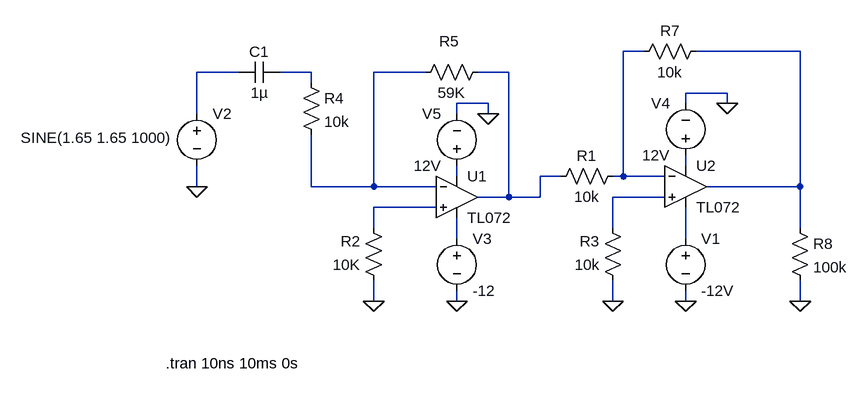
[diagram p0: schematic phr-eurpi-ext-03.asc]
phr-eurpi-ext-03.asc, the LTspice schematic file:
Version 4
SHEET 1 1072 680
WIRE 752 16 720 16
WIRE 992 16 832 16
WIRE 128 48 64 48
WIRE 240 48 192 48
WIRE 416 48 336 48
WIRE 544 48 496 48
WIRE 240 64 240 48
WIRE 880 80 816 80
WIRE 512 96 464 96
WIRE 816 96 816 80
WIRE 880 96 880 80
WIRE 64 112 64 48
WIRE 464 112 464 96
WIRE 512 112 512 96
WIRE 816 192 816 176
WIRE 464 208 464 192
WIRE 624 208 592 208
WIRE 720 208 720 16
WIRE 720 208 704 208
WIRE 784 208 720 208
WIRE 64 224 64 192
WIRE 240 224 240 144
WIRE 336 224 336 48
WIRE 336 224 240 224
WIRE 432 224 336 224
WIRE 992 224 992 16
WIRE 992 224 848 224
WIRE 544 240 544 48
WIRE 544 240 496 240
WIRE 592 240 592 208
WIRE 592 240 544 240
WIRE 784 240 704 240
WIRE 432 256 336 256
WIRE 336 288 336 256
WIRE 704 288 704 240
WIRE 992 288 992 224
WIRE 464 304 464 272
WIRE 816 304 816 256
WIRE 336 400 336 368
WIRE 464 400 464 384
WIRE 704 400 704 368
WIRE 816 400 816 384
WIRE 992 400 992 368
FLAG 64 224 0
FLAG 336 400 0
FLAG 464 400 0
FLAG 512 112 0
FLAG 816 400 0
FLAG 880 96 0
FLAG 704 400 0
FLAG 992 400 0
SYMBOL OpAmps/TL072 464 176 R0
SYMATTR InstName U1
SYMBOL Voltage 64 96 R0
WINDOW 3 -271 53 Left 2
SYMATTR InstName V2
SYMATTR Value SINE(1.65 1.65 1000)
SYMBOL Res 352 384 R180
WINDOW 0 36 76 Left 2
WINDOW 3 36 40 Left 2
SYMATTR InstName R2
SYMATTR Value 10K
SYMBOL Res 224 48 R0
SYMATTR InstName R4
SYMATTR Value 10k
SYMBOL Res 512 32 R90
WINDOW 0 -16 60 VBottom 2
WINDOW 3 32 56 VTop 2
SYMATTR InstName R5
SYMATTR Value 59K
SYMBOL Voltage 464 288 R0
SYMATTR InstName V3
SYMATTR Value -12
SYMBOL Voltage 464 208 R180
WINDOW 0 24 96 Left 2
WINDOW 3 24 16 Left 2
SYMATTR InstName V5
SYMATTR Value 12V
SYMBOL Cap 192 32 R90
WINDOW 0 0 32 VBottom 2
WINDOW 3 32 32 VTop 2
SYMATTR InstName C1
SYMATTR Value 1µ
SYMBOL OpAmps/TL072 816 160 R0
SYMATTR InstName U2
SYMBOL Voltage 816 288 R0
SYMATTR InstName V1
SYMATTR Value -12V
SYMBOL Voltage 816 192 R180
WINDOW 0 24 96 Left 2
WINDOW 3 24 16 Left 2
SYMATTR InstName V4
SYMATTR Value 12V
SYMBOL Res 720 192 R90
WINDOW 0 0 56 VBottom 2
WINDOW 3 32 56 VTop 2
SYMATTR InstName R1
SYMATTR Value 10k
SYMBOL Res 720 384 R180
WINDOW 0 36 76 Left 2
WINDOW 3 36 40 Left 2
SYMATTR InstName R3
SYMATTR Value 10k
SYMBOL Res 848 0 R90
WINDOW 0 0 56 VBottom 2
WINDOW 3 32 56 VTop 2
SYMATTR InstName R7
SYMATTR Value 10k
SYMBOL Res 976 272 R0
SYMATTR InstName R8
SYMATTR Value 100k
TEXT 16 496 Left 2 !.tran 10ns 10ms 0s

The netlist it stands for:
* phr-eurpi-ext-03.asc
XU1 N010 N005 N008 N011 N006 TL072  ; pins In+ In- V+ V- OUT
V2 N003 0 SINE(1.65 1.65 1000)
R2 0 N010 10K
R4 N004 N005 10k
R5 N006 N005 59K
V3 N011 0 -12
V5 N008 0 12V
C1 N004 N003 1µ
XU2 N009 N001 N007 N012 N002 TL072  ; pins In+ In- V+ V- OUT
V1 N012 0 -12V
V4 N007 0 12V
R1 N001 N006 10k
R3 0 N009 10k
R7 N002 N001 10k
R8 N002 0 100k
.tran 10ns 10ms 0s
.backanno
.end